# Altium project Shy-mirror-sensor.PrjPcb
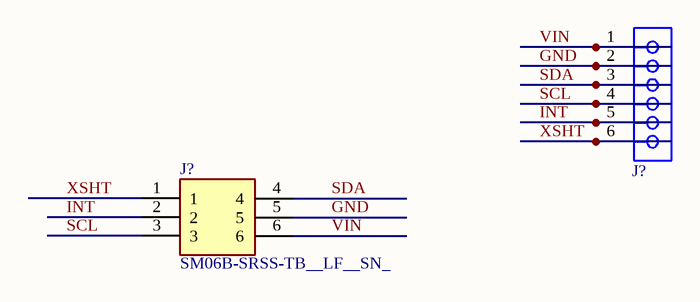
[diagram p0: shy-mirror-sensor-rev.SchDoc]
1 sheet, 2 parts. Net scope: global (net labels, ports and power ports of the same name join across sheets).
Board file: shy-mirror-sensor-revA.PcbDoc

## Sheet shy-mirror-sensor-rev.SchDoc
size A4; SheetNumber: 1; SheetTotal: 1

### Parts
(Parts that share a designator on the sheet are numbered #1, #2 ... from top to bottom, then left to right.)
J?#1  61300611821  [61300611821]  (value not drawn)
J?#2  SM06B-SRSS-TB__LF__SN_  [SM06B-SRSS-TB]

### Nets
GND: J?#1.2 J?#2.5
INT: J?#1.5 J?#2.2
SCL: J?#1.4 J?#2.3
SDA: J?#1.3 J?#2.4
VIN: J?#1.1 J?#2.6
XSHT: J?#1.6 J?#2.1

### Library data of the parts
J?#1 = 61300611821: WR-PHD Socket Header, THT, Vertical, pitch 2.54mm, 1 Row, 6P; Manufacturer: Wurth Elektronik; Contact Resistance: 20mOhm; Rated Current: 3A; Working Voltage: 250V; Withstanding Voltage: 500V; Manufacturer Part Number: 61300611821; Category: Board-to-Board Connectors; Match Code: WR-PHD; ComponentLink1Description: Website Link; ComponentLink1URL: https://www.we-online.com/redexpert/article/61300611821?ad; ComponentLink2Description: Datasheet Link; ComponentLink2URL: https://www.we-online.com/redexpert/spec/61300611821?ad; Mount: Through Hole; Operating Temperature Max: 125°C; Operating Temperature Min: -40°C; Packaging: Tray; Gender: Socket Header; Number of Pins: 6; Number of Rows: 1; Orientation: Vertical; Pitch: 2.54mm
J?#2 = SM06B-SRSS-TB__LF__SN_: Connector; Manufacturer_Name: JST (JAPAN SOLDERLESS TERMINALS); Manufacturer_Part_Number: SM06B-SRSS-TB (LF)(SN); Datasheet Link: http://uk.rs-online.com/web/p/products/5468827